# EAGLE design lcd6 (EAGLE 7.2.0)
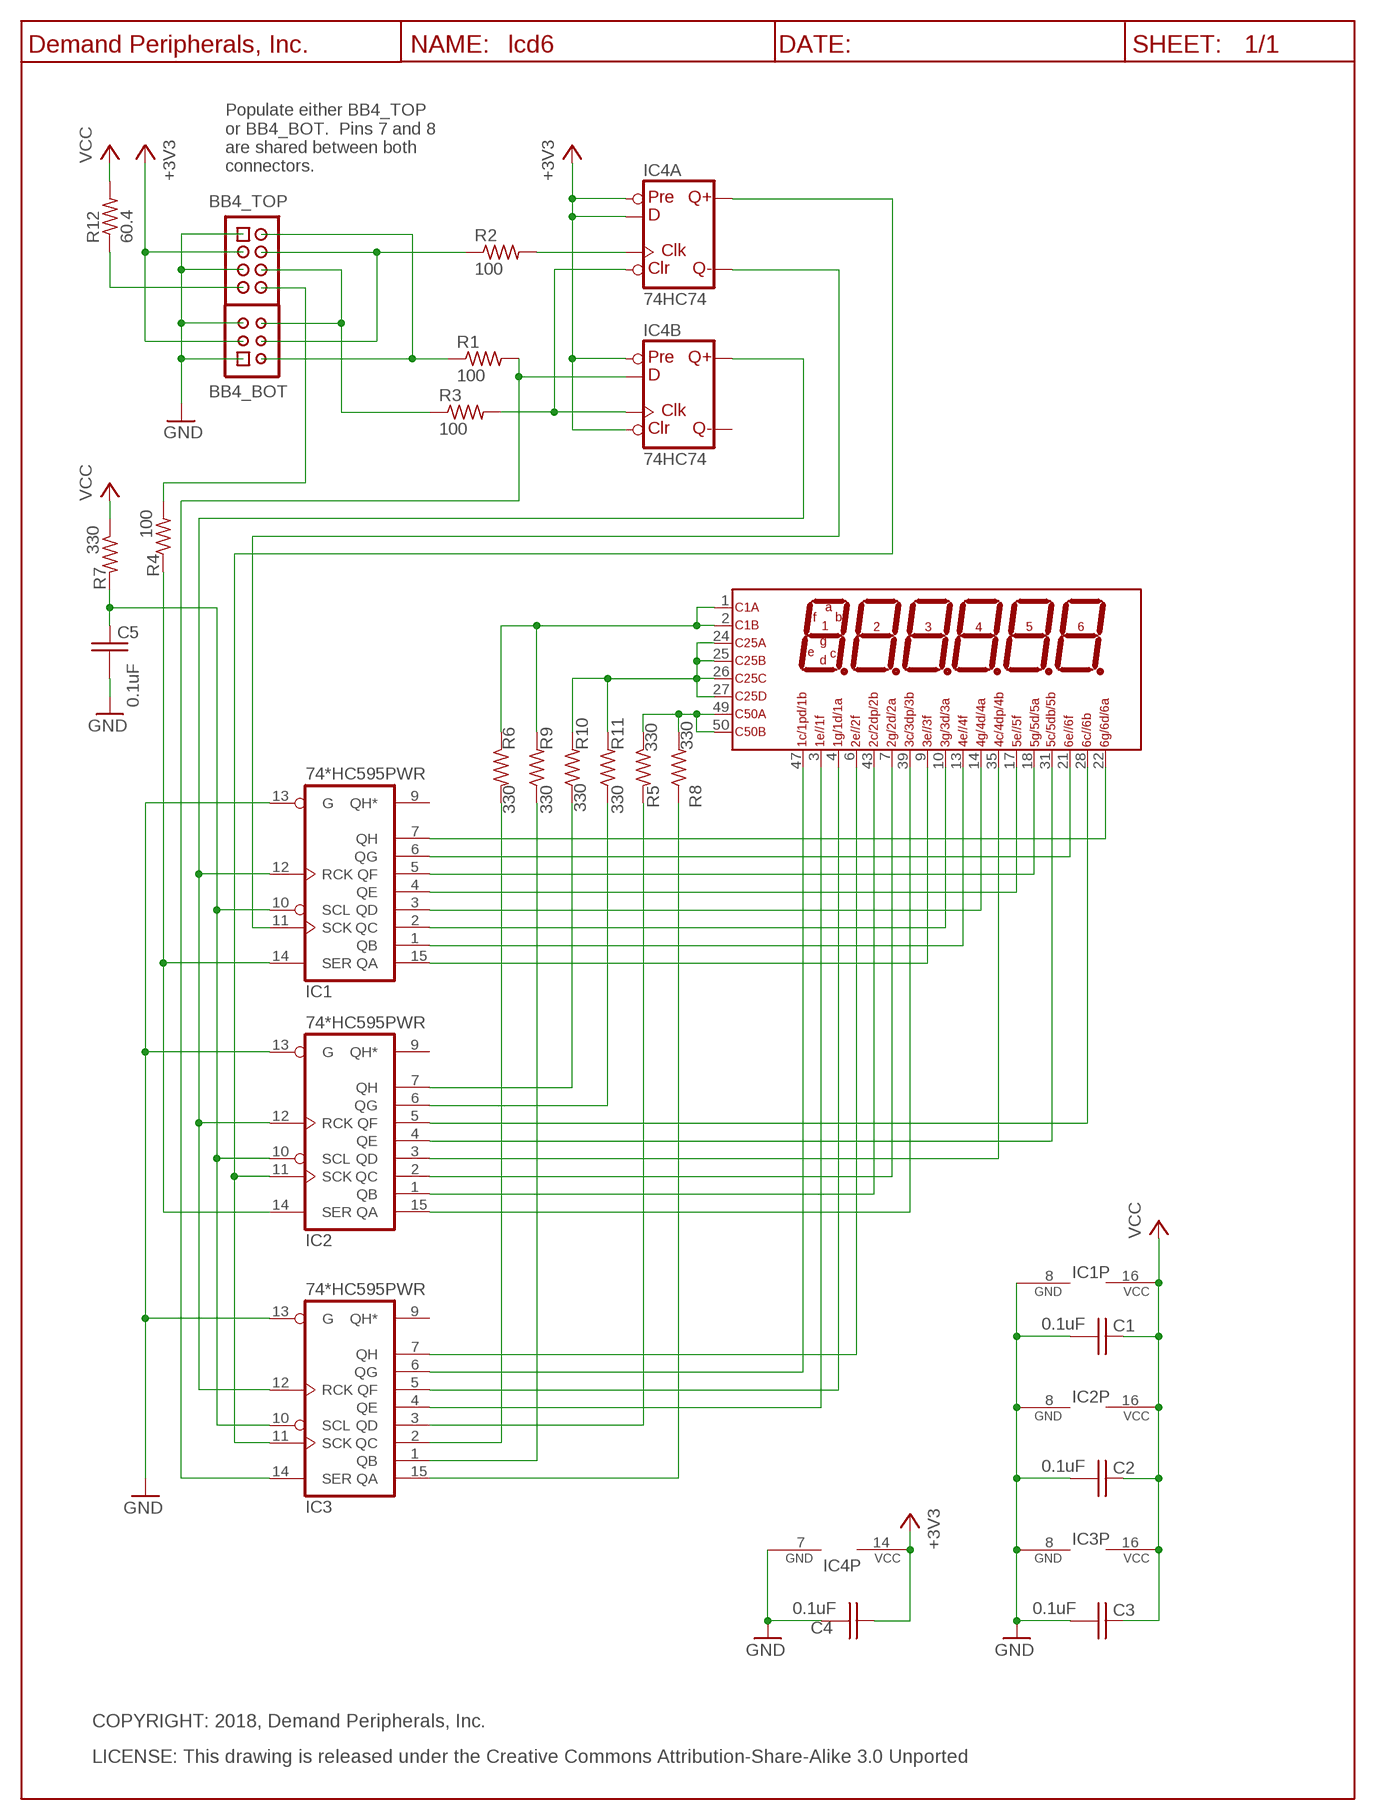
[diagram p0: schematic, sheet 1]

## Parts
BB4_BOT  HDR-3X2  [HDR-3X2]
BB4_TOP  Keyed_Pin_Header_4x2(0.1"x0.1")  HDR-4X2-SHR  [HDR-4X2]
C1  0.1uF  C0.1UF_C0603  [C0603]
C2  0.1uF  C0.1UF_C0603  [C0603]
C3  0.1uF  C0.1UF_C0603  [C0603]
C4  0.1uF  C0.1UF_C0603  [C0603]
C5  0.1uF  C0.1UF_C0603  [C0603]
DISP1  LCD6  [LCD6]
IC1  74*HC595PWR  74595  [SO16]
IC2  74*HC595PWR  74595  [SO16]
IC3  74*HC595PWR  74595  [SO16]
IC4  74HC74  74AHC74SS  [SO14]
R1  100  R100_R0603  [R0603]
R2  100  R100_R0603  [R0603]
R3  100  R100_R0603  [R0603]
R4  100  R100_R0603  [R0603]
R5  330  R330_R0603  [R0603]
R6  330  R330_R0603  [R0603]
R7  330  R330_R0603  [R0603]
R8  330  R330_R0603  [R0603]
R9  330  R330_R0603  [R0603]
R10  330  R330_R0603  [R0603]
R11  330  R330_R0603  [R0603]
R12  60.4  R60.4_R0603  [R0603]
U$1  DP_FRAME_P  [P_FRAME]

## Nets
3A: IC3.15(QA) R8.1
3B: IC3.1(QB) R9.1
+3V3: BB4_BOT.3 BB4_TOP.3 C4.1 IC4.2(A:D) IC4.4(A:PRE) IC4.10(B:PRE) IC4.13(B:CLR) IC4.14(P:VCC)
GND: BB4_BOT.1 BB4_BOT.5 BB4_TOP.1 BB4_TOP.5 C1.2 C2.2 C3.2 C4.2 C5.2 IC1.8(GND) IC1.13(G) IC2.8(GND) IC2.13(G) IC3.8(GND) IC3.13(G) IC4.7(P:GND)
N$1: BB4_TOP.8 R4.2
N$2: IC3.3(QD) R5.2
N$3: IC1.12(RCK) IC2.12(RCK) IC3.12(RCK) IC4.9(B:Q)
N$4: IC2.11(SCK) IC3.11(SCK) IC4.5(A:Q)
N$7: DISP1.3 IC3.4(QE)
N$8: DISP1.4 IC3.5(QF)
N$9: IC3.2(QC) R6.2
N$10: DISP1.24 DISP1.25 DISP1.26 DISP1.27 R10.2 R11.2
N$12: DISP1.47 IC3.6(QG)
N$13: DISP1.6 IC3.7(QH)
N$14: IC2.7(QH) R10.1
N$15: IC2.6(QG) R11.1
N$16: DISP1.22 IC1.7(QH)
N$17: DISP1.21 IC1.6(QG)
N$18: DISP1.18 IC1.5(QF)
N$19: DISP1.17 IC1.4(QE)
N$20: DISP1.14 IC1.3(QD)
N$21: DISP1.13 IC1.1(QB)
N$22: DISP1.10 IC1.2(QC)
N$23: DISP1.28 IC2.5(QF)
N$24: DISP1.31 IC2.4(QE)
N$25: DISP1.35 IC2.3(QD)
N$26: DISP1.9 IC1.15(QA)
N$28: DISP1.39 IC2.15(QA)
N$29: DISP1.7 IC2.2(QC)
N$30: BB4_BOT.2 BB4_TOP.2 R1.1
N$31: DISP1.43 IC2.1(QB)
N$34: IC4.3(A:CLK) R2.2
N$35: IC3.14(SER) IC4.12(B:D) R1.2
N$36: IC4.1(A:CLR) IC4.11(B:CLK) R3.2
N$37: IC1.14(SER) IC2.14(SER) R4.1
N$38: BB4_BOT.6 BB4_TOP.6 R3.1
N$39: IC1.11(SCK) IC4.6(A:!Q)
N$41: BB4_BOT.4 BB4_TOP.4 R2.1
N$65: DISP1.49 DISP1.50 R5.1 R8.2
N$66: C5.1 IC1.10(SCL) IC2.10(SCL) IC3.10(SCL) R7.2
N$67: DISP1.1 DISP1.2 R6.1 R9.2
N$76: BB4_TOP.7 R12.1
VCC: C1.1 C2.1 C3.1 IC1.16(VCC) IC2.16(VCC) IC3.16(VCC) R7.1 R12.2
Unconnected: IC1.9(QH*) IC2.9(QH*) IC3.9(QH*) IC4.8(B:!Q)

## Notes on the sheet
- Populate either BB4_TOP
  or BB4_BOT.  Pins 7 and 8
  are shared between both
  connectors.
- COPYRIGHT: 2018, Demand Peripherals, Inc.
- LICENSE: This drawing is released under the Creative Commons Attribution-Share-Alike 3.0 Unported

## Library data of the parts
BB4_BOT = dpi-conn:HDR-3X2: Unshrouded 3x2 header with 0.1 inch pitch; VENDOR: Digikey; VENDOR-PART-NUM: 952-2120-ND
BB4_TOP = dpi-conn:HDR-4X2-SHR: Shrouded 4x2 pin header; VENDOR: Digikey; VENDOR-PART-NUM: 609-3530-ND
C1-C5 = dpi-passive:C0.1UF_: 0.1 uF Capacitor, 25V, X7R; VENDOR: Digikey; VENDOR-PART-NUM: 1276-1126-2-ND
DISP1 = dpi-diopto:LCD6: Six digit 7-segment LCD display
IC1-IC3 = dpi-transic:74*595: 8-bit SHIFT REGISTER, output latch; VENDOR: Digikey; VENDOR-PART-NUM: 74HC595D(BJ)CT-ND
IC4 = dpi-transic:74AHC74: Dual D type positive edge triggered FLIP FLOP, preset and clear; VENDOR: Digikey; VENDOR-PART-NUM: 568-4458-1-ND
R1-R4 = dpi-passive:R100_: 100 Ohm resistor, 1%, 0.1 watt; VENDOR: Digikey; VENDOR-PART-NUM: 311-100HRTR-ND
R5-R11 = dpi-passive:R330_: 330 Ohm resistor, 1%, 0.1 watt; VENDOR: Digikey; VENDOR-PART-NUM: 311-330HRTR-ND
R12 = dpi-passive:R60.4_: 60.4 Ohm resistor, 1%, 0.1 watt; VENDOR: Digikey; VENDOR-PART-NUM: 311-60.4HRCT-ND
U$1 = dpi-sym:DP_FRAME_P: Portrait/Letter Document Frame

## Board
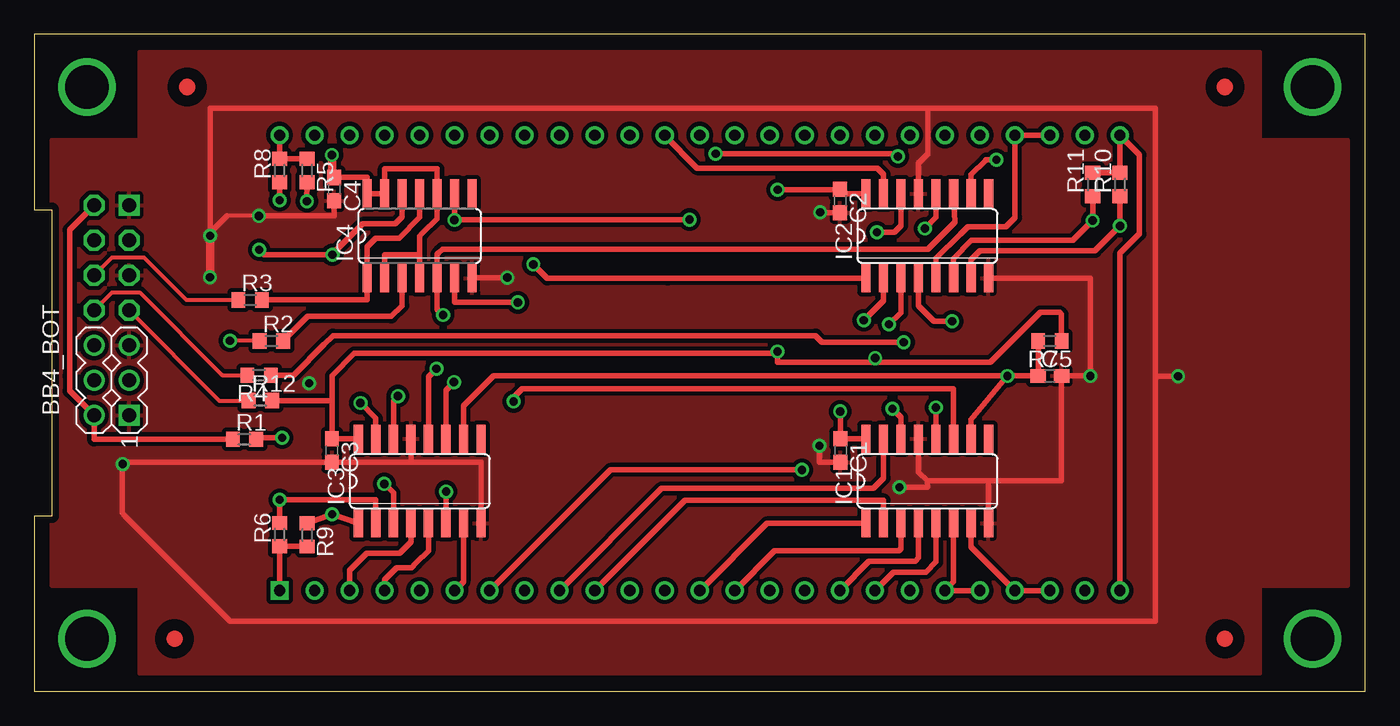
[diagram p1: board, top side]
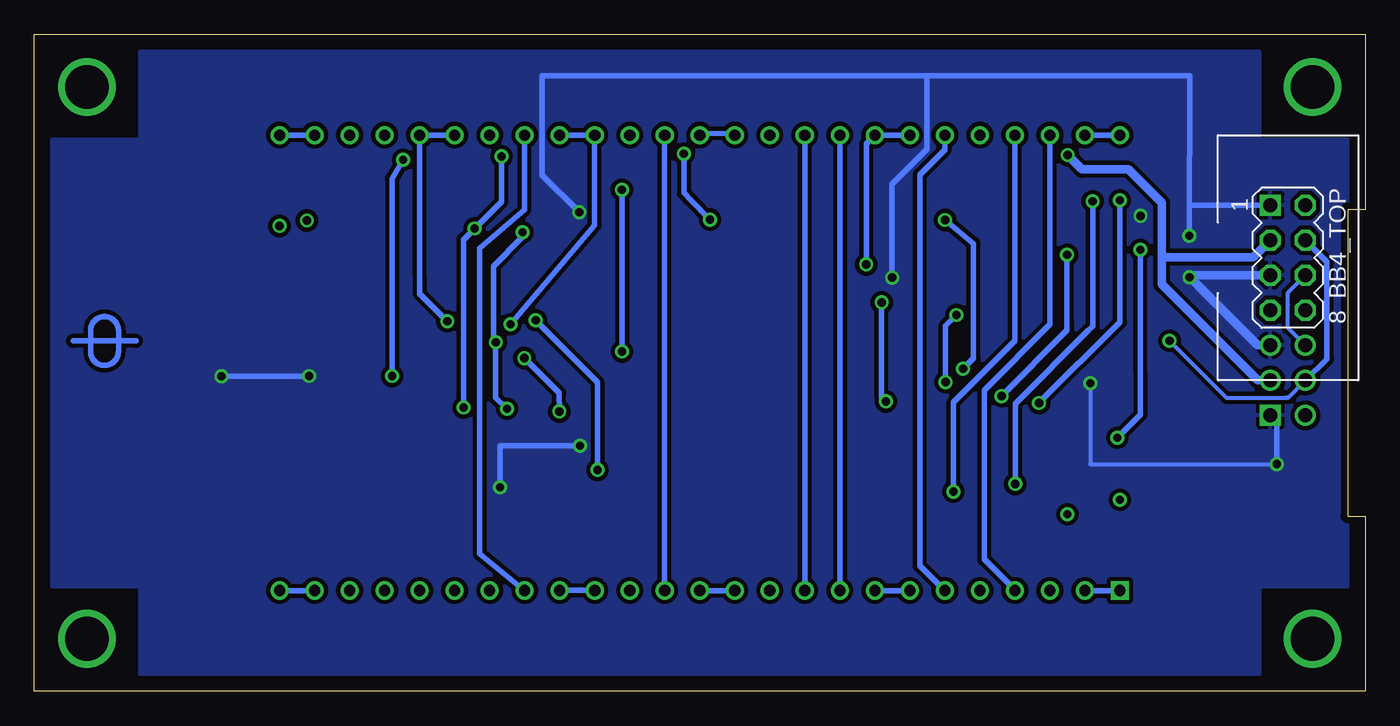
[diagram p2: board, bottom side, seen from below]

Size 96.52 x 47.62 mm. Coordinates in mm from the lower left corner, seen from the top.
Outline: 0,0 96.52,0 96.52,47.62 0,47.62 0,34.92 1.27,34.92 1.27,12.7 0,12.7 0,0
Copper layers (1*16): Top 0.035mm / dielectric 1.5mm / Bottom 0.035mm
Design rules "default *": minimum track width 10mil, minimum drill 20mil, track to track 12mil, track to pad 12mil, pad to pad 12mil, via to via 12mil, smd to smd 12mil, copper to edge 20mil, drill to drill 12mil, minimum pad ring 10mil, minimum via ring 8mil, stop-mask expansion 4mil, vias tented up to drill 0mil, thermal gap 10mil

### Footprints (pad centres in the part's own frame; a part is rotated, then mirrored left to right if it is on the bottom)
HDR-3X2 = drill 1.016 square: 1 -2.54,-1.27 | drill 1.016: 2 -2.54,1.27; 3 0,-1.27; 4 0,1.27; 5 2.54,-1.27; 6 2.54,1.27
HDR-4X2 = drill 1.016 square: 1 -3.81,-1.27 | drill 1.016 octagon: 2 -3.81,1.27; 3 -1.27,-1.27; 4 -1.27,1.27; 5 1.27,-1.27; 6 1.27,1.27; 7 3.81,-1.27; 8 3.81,1.27
C0603 = smd 1.1 x 1: 1 -0.85,0; 2 0.85,0
LCD6 = drill 0.813 square: 1 -30.48,-16.51 | drill 0.813: 2 -27.94,-16.51; 3 -25.4,-16.51; 4 -22.86,-16.51; 5 -20.32,-16.51; 6 -17.78,-16.51; 7 -15.24,-16.51; 8 -12.7,-16.51; 9 -10.16,-16.51; 10 -7.62,-16.51; 11 -5.08,-16.51; 12 -2.54,-16.51; 13 0,-16.51; 14 2.54,-16.51; 15 5.08,-16.51; 16 7.62,-16.51; 17 10.16,-16.51; 18 12.7,-16.51; 19 15.24,-16.51; 20 17.78,-16.51; 21 20.32,-16.51; 22 22.86,-16.51; 23 25.4,-16.51; 24 27.94,-16.51; 25 30.48,-16.51; 26 30.48,16.51; 27 27.94,16.51; 28 25.4,16.51; 29 22.86,16.51; 30 20.32,16.51; 31 17.78,16.51; 32 15.24,16.51; 33 12.7,16.51; 34 10.16,16.51; 35 7.62,16.51; 36 5.08,16.51; 37 2.54,16.51; 38 0,16.51; 39 -2.54,16.51; 40 -5.08,16.51; 41 -7.62,16.51; 42 -10.16,16.51; 43 -12.7,16.51; 44 -15.24,16.51; 45 -17.78,16.51; 46 -20.32,16.51; 47 -22.86,16.51; 48 -25.4,16.51; 49 -27.94,16.51; 50 -30.48,16.51
SO16 = smd 0.66 x 2.032: 1 -4.445,-3.073; 2 -3.175,-3.073; 3 -1.905,-3.073; 4 -0.635,-3.073; 5 0.635,-3.073; 6 1.905,-3.073; 7 3.175,-3.073; 8 4.445,-3.073; 9 4.445,3.073; 10 3.175,3.073; 11 1.905,3.073; 12 0.635,3.073; 13 -0.635,3.073; 14 -1.905,3.073; 15 -3.175,3.073; 16 -4.445,3.073
SO14 = smd 0.66 x 2.032: 1 -3.81,-3.073; 2 -2.54,-3.073; 3 -1.27,-3.073; 4 0,-3.073; 5 1.27,-3.073; 6 2.54,-3.073; 7 3.81,-3.073; 8 3.81,3.073; 9 2.54,3.073; 10 1.27,3.073; 11 0,3.073; 12 -1.27,3.073; 13 -2.54,3.073; 14 -3.81,3.073
R0603 = smd 1 x 1.1: 1 -0.85,0; 2 0.85,0

### Placement (x,y rotation side)
BB4_BOT  5.59,22.54 90 top
BB4_TOP  5.59,31.43 270 bottom
C1  58.47,17.46 270 top
C2  58.44,35.56 270 top
C3  21.58,17.46 270 top
C4  21.74,36.41 270 top
C5  73.66,22.86 0 top
DISP1  48.26,23.81 0 top
IC1  64.77,15.24 0 top
IC2  64.77,33.02 0 top
IC3  27.94,15.24 0 top
IC4  27.94,33.02 0 top
R1  15.24,18.26 0 top
R2  17.2,25.4 0 top
R3  15.65,28.37 0 top
R4  16.29,22.92 180 top
R5  19.77,37.76 270 top
R6  17.78,11.35 90 top
R7  73.66,25.4 180 top
R8  17.78,37.76 90 top
R9  19.77,11.34 270 top
R10  78.74,36.74 90 top
R11  76.76,36.74 90 top
R12  16.4,21.08 0 top
U$1  -2.54,-2.54 0 top
U$3  [FIDUCIAL]  86.36,3.81 270 top
U$4  [FIDUCIAL]  86.36,43.81 270 top
U$5  [FIDUCIAL]  10.16,3.81 0 top
U$6  [FIDUCIAL]  11.07,43.81 0 top
U$7  [DPI-1]  91.44,25.4 270 bottom

### Tracks (layer width: path | path; a pad name or v marks a point on that pad's centre or on a via)
3A  (via drill 0.6)
  Top 0.406: IC3.15 24.77,19.79 v23.65,20.9 | v17.78,35.6 R8.1
  Bottom 0.406: v23.65,20.9 17.78,26.77 v17.78,35.6
3B  (via drill 0.6)
  Top 0.406: IC3.1 23.5,12.19 v21.59,12.83 R9.1
+3V3  (via drill 0.6)
  Top 0.406: C4.1 24.13,37.26 IC4.14 IC4.13 25.4,37.88 28.59,37.88 29.21,37.88 IC4.10 29.21,34.28 28.13,33.2 27.94,33.01 27.94,31.66 | 27.94,31.66 IC4.4 | IC4.2 25.4,31.66 27.94,31.66
  Top 0.61: v21.58,38.89 21.58,37.42 C4.1
  Bottom 0.61: 14.74,31.47 14.74,35.41 17.18,37.85 20.54,37.85 v21.58,38.89 | BB4_TOP.3 8.1,31.47 14.74,31.47 | 14.74,31.47 14.74,29.52 14.67,29.44 7.77,22.54 BB4_BOT.3
GND  (via drill 0.6)
  Top 0.305: v16.28,34.47 13.97,34.47
  Top 0.406: IC1.13 64.14,15.89 64.77,15.25 | 64.77,15.25 69.33,15.25 | 69.33,15.25 74.51,15.25 C5.2 v76.59,22.86 76.59,29.95 IC2.8 | IC1.8 69.22,15.14 69.33,15.25 | IC2.13 64.14,38.3 64.49,38.66 64.8,38.96 64.8,42.28 | 64.8,42.28 81.29,42.28 81.29,22.86 | 81.29,22.86 81.29,5.07 14.21,5.07 6.59,12.69 6.35,12.93 6.35,16.47 v6.4,16.47 6.4,16.61 C3.2 27.62,16.61 | v82.96,22.85 81.29,22.85 81.29,22.86 | 27.62,16.61 32.38,16.61 IC3.8 | IC3.13 27.3,16.61 27.62,16.61 | IC4.7 31.75,30 v34.3,30 | 13.97,34.47 12.74,33.24 v12.74,33.03 12.74,42.28 64.8,42.28 | C1.2 56.95,16.61 v56.95,17.8 | v62.75,14.8 64.77,14.8 64.77,15.25 | C2.2 57.02,34.71 v57,34.73 | C4.2 21.75,34.47 v16.28,34.47
  Top 0.61: v12.74,33.03 v12.74,30.02 v12.72,30.02
  Bottom 0.305: v19.93,22.34 19.93,16.47 v6.4,16.47 | 6.4,20 BB4_BOT.1
  Bottom 0.406: v76.59,22.86 76.61,22.85 v82.96,22.85 | v34.3,30 34.3,36.78 31.84,39.24 31.77,39.31 31.77,44.63 | 31.77,44.63 12.72,44.63 v12.74,33.03 12.74,35.24 BB4_TOP.1 | 31.77,44.63 59.69,44.63 59.69,41.63 59.69,37.43 v57,34.73 | v56.95,17.8 62.75,17.8 v62.75,14.8 | 6.4,20 v6.4,16.47
  Bottom 0.61: v12.72,30.02 12.72,30.16 BB4_TOP.5 | 12.71,30.01 v12.72,30.02 | v12.72,30.02 7.79,25.08 BB4_BOT.5
  pour Top: 1.27,7.62 1.27,40.01 7.62,40.01 7.62,46.35 88.9,46.35 88.9,40.01 95.25,40.01 95.25,7.62 88.9,7.62 88.9,1.27 7.62,1.27 7.62,7.62
  pour Bottom: 1.27,7.62 1.27,40.01 7.62,40.01 7.62,46.35 88.9,46.35 88.9,40.01 95.25,40.01 95.25,7.62 88.9,7.62 88.9,1.27 7.62,1.27 7.62,7.62
MOUNT0  (via drill 3.17 pad 3.17)
  other vias: 3.81,3.81
MOUNT1  (via drill 3.17 pad 3.17)
  other vias: 3.81,43.81
MOUNT6  (via drill 3.17 pad 3.17)
  other vias: 92.71,3.81
MOUNT7  (via drill 3.17 pad 3.17)
  other vias: 92.71,43.81
N$1
  Top 0.305: BB4_TOP.8 5.63,28.92 7.63,28.92 13.63,22.92 R4.2
N$2  (via drill 0.6)
  Top 0.406: IC3.3 26.04,14.38 v25.38,15.04 | v19.76,35.53 R5.2
  Bottom 0.406: v25.38,15.04 25.38,20.85 20.05,26.18 19.76,26.47 v19.76,35.53
N$3  (via drill 0.6)
  Top 0.406: IC1.12 65.41,20.56 v65.39,20.57 | v64.59,33.55 65.41,34.37 IC2.12 | v30.47,34.18 IC4.9 30.48,34.2 v47.51,34.2 | v62.64,38.79 62.45,38.98 v49.42,38.98 | IC3.12 28.57,22.81 v29.16,23.39
  Bottom 0.406: v65.39,20.57 65.39,32.75 v64.59,33.55 62.64,35.51 v62.64,38.79 | v30.47,34.18 28.4,32.46 28.4,24.16 v29.16,23.39 | v49.42,38.98 49.42,36.14 48.88,35.61 v47.51,34.2
N$4  (via drill 0.6)
  Top 0.406: IC2.11 66.75,34.01 64.8,32.05 29.59,32.05 29.31,31.79 29.21,31.69 IC4.5 29.21,27.7 v29.64,27.28 | v30.43,22.42 29.84,21.83 IC3.11
  Bottom 0.406: v30.43,22.42 30.43,26.49 v29.64,27.28
N$7
  Top 0.406: IC3.4 27.3,10.83 26.49,10.02 24.11,10.02 23.27,9.18 22.86,8.78 DISP1.3
N$8
  Top 0.406: IC3.5 28.57,10.19 27.66,9.27 27.36,8.97 26.28,8.97 25.4,8.09 DISP1.4
N$9  (via drill 0.6)
  Top 0.406: IC3.2 24.77,13.88 v17.78,13.88 R6.2
N$10
  Top 0.406: R11.2 R10.2 DISP1.26 80.16,38.9 80.16,33.17 78.74,31.75 DISP1.25
  Bottom 0.406: DISP1.25 DISP1.24 | DISP1.27 DISP1.26
N$12  (via drill 0.6)
  Top 0.406: IC3.6 29.84,14.46 v29.86,14.48
  Bottom 0.406: v29.86,14.48 29.86,20.94 25.4,25.4 DISP1.47
N$13
  Top 0.406: IC3.7 31.11,7.94 DISP1.6
N$14  (via drill 0.6)
  Top 0.406: IC2.7 67.94,31.29 68.58,31.93 76.92,31.93 v78.74,33.75 R10.1
N$15  (via drill 0.6)
  Top 0.406: IC2.6 66.67,31.36 67.96,32.69 75.31,32.69 v76.76,34.14 R11.1
N$16
  Top 0.406: IC1.7 67.94,10.48 DISP1.22
N$17
  Top 0.406: IC1.6 66.67,7.94 66.04,7.3 DISP1.21
N$18
  Top 0.406: IC1.5 65.41,9.37 64.67,8.64 62.29,8.64 DISP1.18
N$19
  Top 0.406: IC1.4 64.14,9.66 63.89,9.42 60.54,9.42 DISP1.17
N$20
  Top 0.406: IC1.3 62.87,10.35 62.71,10.2 53.7,10.2 DISP1.14
N$21
  Top 0.406: IC1.1 53.12,12.17 DISP1.13
N$22
  Top 0.406: IC1.2 61.59,13.84 59.68,13.84 47.18,13.84 DISP1.10
N$23
  Top 0.406: IC2.5 65.41,31.39 67.16,33.15 67.73,33.69 70.48,33.69 71.13,34.34 71.13,40.28 71.17,40.32 DISP1.28
N$24  (via drill 0.6)
  Top 0.406: IC2.4 64.14,27.94 65.24,26.84 v66.57,26.84
  Bottom 0.406: DISP1.31 68.56,40.32 68.57,40.34 68.57,30.09 68.57,28.83 v66.57,26.84
N$25  (via drill 0.6)
  Top 0.406: IC2.3 62.87,27.43 v61.98,26.61
  Bottom 0.406: v61.98,26.61 55.88,33.8 DISP1.35
N$26
  Top 0.406: DISP1.9 45.5,14.71 60.85,14.71 61.59,15.46 IC1.15
N$28
  Top 0.406: DISP1.39 48.04,37.94 60.34,37.94 61.14,37.94 61.59,37.48 IC2.15
N$29  (via drill 0.6)
  Top 0.406: IC2.2 61.59,28.88 61.59,28.33 v60.16,26.9 | v55.68,16.05 41.77,16.05 DISP1.7
  Bottom 0.406: v60.16,26.9 55.68,22.42 v55.68,16.05
N$30
  Top 0.406: R1.1 4.32,18.26 BB4_BOT.2 2.54,21.78 2.54,22.86 2.54,33.45 BB4_TOP.2
N$31  (via drill 0.6)
  Top 0.406: IC2.1 45.94,29.95 37.19,29.95 v36.18,30.95
  Bottom 0.406: 32.94,40.32 DISP1.43 36.18,39.7 v36.18,30.95
N$34
  Top 0.406: IC4.3 26.67,27.96 25.88,27.18 19.82,27.18 R2.2
N$35  (via drill 0.6)
  Top 0.406: IC3.14 26.04,21.07 v26.36,21.4 | v16.29,32.02 16.66,31.65 v21.61,31.65 21.61,31.73 23.79,33.9 26.18,33.9 26.67,34.39 IC4.12 | R1.2 16.2,18.38 v17.97,18.38
  Bottom 0.406: v26.36,21.4 21.61,26.18 21.61,26.66 v21.61,31.65 | v16.29,32.02 16.29,23.04 16.29,20.05 v17.97,18.38
N$36
  Top 0.406: IC4.11 27.94,34.35 26.44,32.85 24.77,32.85 24.4,32.49 24.13,32.22 IC4.1 24.13,28.37 R3.2
N$37  (via drill 0.6)
  Top 0.406: IC1.14 62.87,19.86 v62.24,20.48 | IC2.14 62.87,33.77 62.38,33.29 v61.11,33.29 | v63.06,25.31 57.58,25.31 57.14,25.31 56.66,25.79 21.65,25.79 21.01,25.15 18.78,22.92 R4.1
  Bottom 0.406: v61.11,33.29 61.11,32.96 63.23,30.84 63.23,25.49 v63.06,25.31 63.06,21.3 v62.24,20.48
N$38
  Top 0.305: BB4_TOP.6 5.63,31.46 7.94,31.46 11.02,28.37 R3.1
  Bottom 0.305: BB4_TOP.6 5.6,28.89 5.6,28.03 5.6,26.36 BB4_BOT.6
N$39  (via drill 0.6)
  Top 0.406: IC1.11 66.67,21.93 35.36,21.93 34.75,21.32 v34.75,21.02 | v35.06,28.19 30.48,28.19 IC4.6
  Bottom 0.406: v34.75,21.02 35.06,21.34 v35.06,28.19
N$41  (via drill 0.6)
  Top 0.305: R2.1 16.33,25.41 v14.19,25.41
  Bottom 0.305: v14.19,25.41 10.06,21.29 5.74,21.29 5.58,21.29 BB4_BOT.4
  Bottom 0.406: BB4_TOP.4 2.77,31.14 2.77,30.48 2.77,24.09 BB4_BOT.4
N$42
  Top 0.406: 71.25,7.3 73.6,7.3 73.6,7.32
N$56
  Bottom 0.406: 60.98,7.29 64.22,9.98 64.22,32.13 60.98,34.92 60.98,40.37
N$61
  Bottom 0.406: 55.98,40.31 58.55,40.31
N$65
  Top 0.406: R5.1 19.53,38.61 R8.2 DISP1.50
  Bottom 0.406: DISP1.49 DISP1.50
N$66  (via drill 0.6)
  Top 0.406: IC2.10 67.94,37.47 69,38.52 69.03,38.54 v69.77,38.54 | v70.57,22.86 C5.1 R7.2 | IC1.10 67.94,19.67 v70.57,22.86 | IC3.10 31.11,20.69 31.77,21.35 33.29,22.86 v70.57,22.86
  Bottom 0.406: v69.77,38.54 70.59,37.17 v70.57,22.86
N$67
  Top 0.406: R9.2 19.77,10.5 R6.1 DISP1.1
  Bottom 0.406: DISP1.2 DISP1.1
N$72
  Bottom 0.406: 58.47,7.33 55.96,7.33
N$74
  Bottom 0.406: 45.7,40.44 48.2,40.45
N$76
  Top 0.305: R12.1 13.4,21.08 BB4_TOP.7
N$77
  Bottom 0.406: 45.66,7.29 48.27,7.29
N$78
  Bottom 0.406: 50.8,7.29 50.8,40.3
N$79
  Bottom 0.406: 40.64,7.35 40.64,40.3
N$80
  Bottom 0.406: 38.1,40.06 38.1,7.62
N$81
  Bottom 0.406: 33.03,7.3 35.51,7.3
N$82
  Bottom 0.406: 30.49,7.29 32.3,9.09 32.3,37.45 30.48,39.27 30.48,40.01
N$83
  Bottom 0.406: 25.44,7.38 27.62,9.56 27.62,21.83 22.85,26.61 22.85,40.25
VCC  (via drill 0.6)
  Top 0.406: R7.1 74.51,27.33 74.37,27.47 72.96,27.47 69.34,23.85 60.98,23.85 | v53.91,36.36 58.39,36.36 C2.1 58.75,36.09 IC2.16 | v58.45,20.3 58.47,20.27 C1.1 IC1.16 | 21.58,21.08 21.58,20.23 C3.1 IC3.16 | 21.58,21.08 21.58,22.87 23.2,24.5 51.66,24.5 53.76,24.5 v53.9,24.64 53.91,24.62 53.91,23.85 60.98,23.85 | 60.98,23.85 v60.98,24.16 | 21.58,21.08 R12.2
  Bottom 0.406: v53.91,36.36 v53.9,24.64 | v58.45,20.3 58.46,21.63 v60.98,24.16

### Text on the board
tTest: 3.8 Inches | 3.5 Inches | R8 | C2 | R11 | R10 | R5 | C4 | IC2 | IC4 | R3 | R7 | R2 | R4 | R12 | C5 | C3 | R1 | C1 | 1.575 Inches | 1.875 Inches | IC3 | BB4_TOP | IC1 | R6 | R9 | (C) 2019, Demand Peripherals, Inc. | LCD6, Rev 19A
bTest: BB4_BOT